# Altium schematic sheet MCU.SchDoc
size A
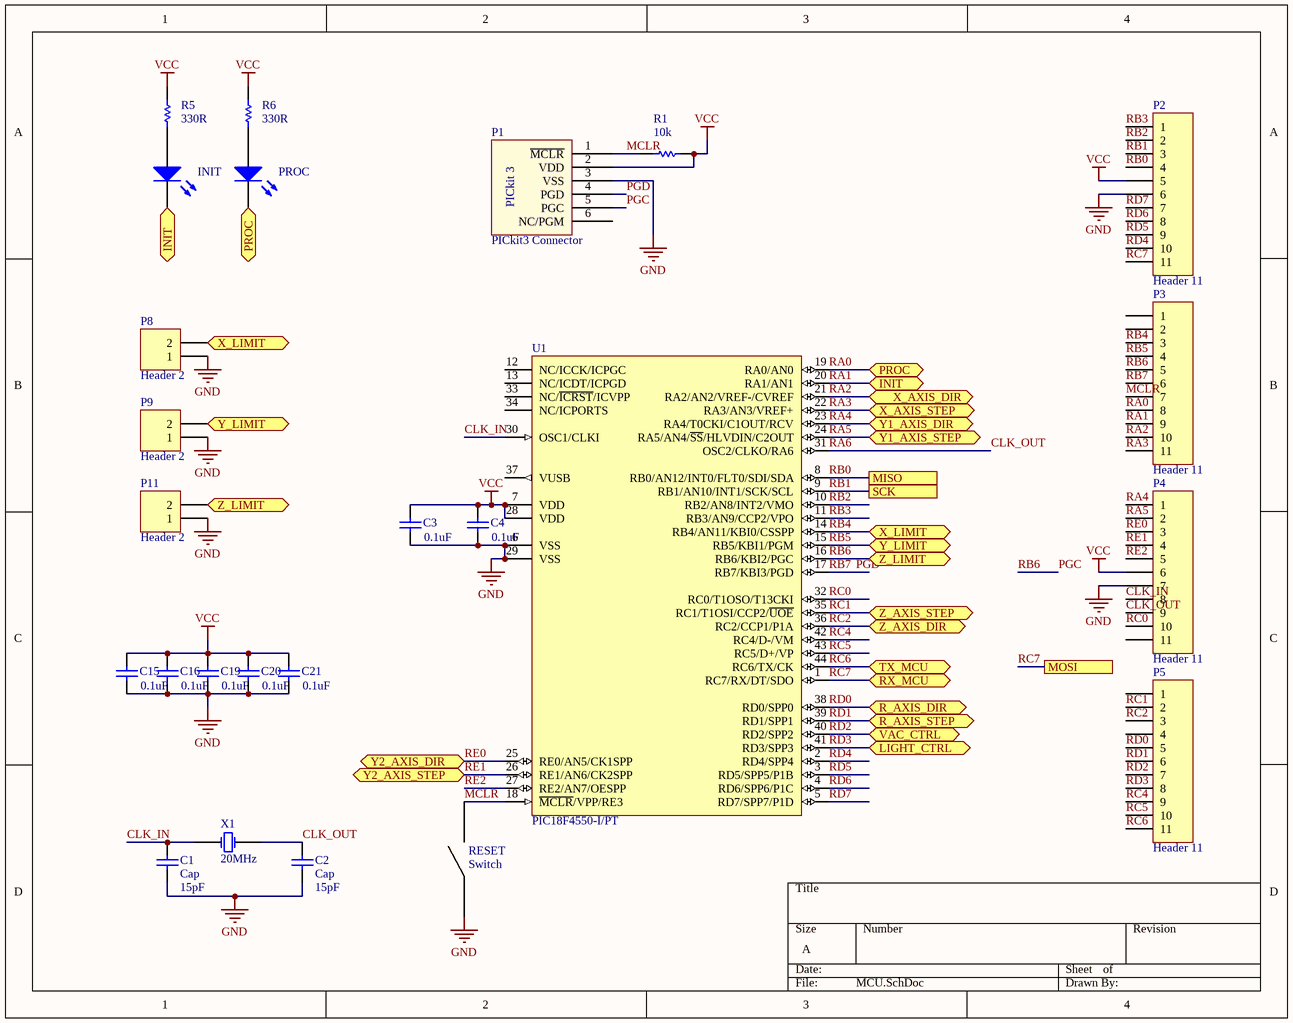
[diagram p0: MCU.SchDoc]

## Parts
C1  Cap  value 15pF  [0603]
C2  Cap  value 15pF  [0603]
C3  value 0.1uF  [0805]  (hidden comment: Cap)
C4  value 0.1uF  [0805]  (hidden comment: Cap)
C15  value 0.1uF  [0805]  (hidden comment: Cap)
C16  value 0.1uF  [0805]  (hidden comment: Cap)
C19  value 0.1uF  [0805]  (hidden comment: Cap)
C20  value 0.1uF  [0805]  (hidden comment: Cap)
C21  value 0.1uF  [0805]  (hidden comment: Cap)
INIT  LED1  [0805]  (value not drawn)
P1  PICkit3 Connector  [Right Angle PICkit Connector]
P2  Header 11  [HDR1X11]
P3  Header 11  [HDR1X11]
P4  Header 11  [HDR1X11]
P5  Header 11  [HDR1X11]
P8  Header 2  [HDR1X2]
P9  Header 2  [HDR1X2]
P11  Header 2  [HDR1X2]
PROC  LED2  [0805]  (value not drawn)
R1  value 10k  [0805]  (hidden comment: Res1)
R5  value 330R  [6-0805_N]  (hidden comment: Res1)
R6  value 330R  [6-0805_N]  (hidden comment: Res1)
RESET  Switch  [TACT_SWITCH]
U1  PIC18F4550-I/PT  [TQFP-PT44_N]
X1  Frequency: 20MHz  [HC49-US]  (hidden comment: Crystal)

## Ports
INIT, LIGHT_CTRL, MISO, MOSI, PROC, R_AXIS_DIR, R_AXIS_STEP, RX_MCU, SCK, TX_MCU, VAC_CTRL, X_AXIS_DIR, X_AXIS_STEP, X_LIMIT, Y1_AXIS_DIR, Y1_AXIS_STEP, Y2_AXIS_DIR, Y2_AXIS_STEP, Y_LIMIT, Z_AXIS_DIR, Z_AXIS_STEP, Z_LIMIT

## Nets
1: RESET.2
4: RESET.4
GND: C1.1 C2.1 C3.1 C4.1 C15.1 C16.1 C19.1 C20.1 C21.1 P1.3(VSS) P2.6 P4.7 P8.1 P9.1 P11.1 RESET.1 U1.6(VSS) U1.29(VSS)
VCC: C3.2 C4.2 C15.2 C16.2 C19.2 C20.2 C21.2 P1.2(VDD) P2.5 P4.6 R1.2 R5.2 R6.2 U1.7(VDD) U1.28(VDD)
CLK_IN: C1.2 P4.8 U1.30(OSC1/CLKI) X1.1(OSC1)
CLK_OUT: C2.2 P4.9 U1.31(OSC2/CLKO/RA6) X1.2(OSC2)  [also labelled RA6]
MCLR: P1.1(~{MCLR}) P3.7 R1.1 RESET.3 U1.18(~{MCLR}/VPP/RE3)
PGC: P1.5(PGC) P3.5 P11.2 U1.16(RB6/KBI2/PGC) ; port Z_LIMIT  [also labelled RB6]
PGD: P1.4(PGD) P3.6 U1.17(RB7/KBI3/PGD)  [also labelled RB7]
RA0: P3.8 PROC.2(K) U1.19(RA0/AN0) ; port PROC
RA1: INIT.2(K) P3.9 U1.20(RA1/AN1) ; port INIT
RA2: P3.10 U1.21(RA2/AN2/VREF-/CVREF) ; port X_AXIS_DIR
RA3: P3.11 U1.22(RA3/AN3/VREF+) ; port X_AXIS_STEP
RA4: P4.1 U1.23(RA4/T0CKI/C1OUT/RCV) ; port Y1_AXIS_DIR
RA5: P4.2 U1.24(RA5/AN4/~{SS}/HLVDIN/C2OUT) ; port Y1_AXIS_STEP
RB0: P2.4 U1.8(RB0/AN12/INT0/FLT0/SDI/SDA) ; port MISO
RB1: P2.3 U1.9(RB1/AN10/INT1/SCK/SCL) ; port SCK
RB2: P2.2 U1.10(RB2/AN8/INT2/VMO)
RB3: P2.1 U1.11(RB3/AN9/CCP2/VPO)
RB4: P3.3 P8.2 U1.14(RB4/AN11/KBI0/CSSPP) ; port X_LIMIT
RB5: P3.4 P9.2 U1.15(RB5/KBI1/PGM) ; port Y_LIMIT
RC0: P4.10 U1.32(RC0/T1OSO/T13CKI)
RC1: P5.2 U1.35(RC1/T1OSI/CCP2/~{UOE}) ; port Z_AXIS_STEP
RC2: P5.3 U1.36(RC2/CCP1/P1A) ; port Z_AXIS_DIR
RC4: P5.9 U1.42(RC4/D-/VM)
RC5: P5.10 U1.43(RC5/D+/VP)
RC6: P5.11 U1.44(RC6/TX/CK) ; port TX_MCU
RC7: P2.11 U1.1(RC7/RX/DT/SDO) ; port MOSI, port RX_MCU
RD0: P5.5 U1.38(RD0/SPP0) ; port R_AXIS_DIR
RD1: P5.6 U1.39(RD1/SPP1) ; port R_AXIS_STEP
RD2: P5.7 U1.40(RD2/SPP2) ; port VAC_CTRL
RD3: P5.8 U1.41(RD3/SPP3) ; port LIGHT_CTRL
RD4: P2.10 U1.2(RD4/SPP4)
RD5: P2.9 U1.3(RD5/SPP5/P1B)
RD6: P2.8 U1.4(RD6/SPP6/P1C)
RD7: P2.7 U1.5(RD7/SPP7/P1D)
RE0: P4.3 U1.25(RE0/AN5/CK1SPP) ; port Y2_AXIS_DIR
RE1: P4.4 U1.26(RE1/AN6/CK2SPP) ; port Y2_AXIS_STEP
RE2: P4.5 U1.27(RE2/AN7/OESPP)
NetINIT_1: INIT.1(A) R5.1
NetPROC_1: PROC.1(A) R6.1

Not connected (* = marked no-connect by the designer): P1 6(NC/PGM); P3 1 2; P4 11; P5 1 4; U1 12(NC/ICCK/ICPGC) 13(NC/ICDT/ICPGD) 33(NC/~{ICRST}/ICVPP) 34(NC/ICPORTS) 37(VUSB)

## Notes on the sheet
- (in symbol PICkit 3 Connector) PICkit 3

## Library data of the parts
C1-C4 C15 C16 C19-C21 = Cap: Capacitor; Published: 8-Jun-2000; LatestRevisionDate: 17-Jul-2002; LatestRevisionNote: Re-released for DXP Platform.; PackageReference: RAD-0.3; Publisher: Altium Limited; PackageDescription: Radial Cap, Thru-Hole; 2 Leads; 0.3 in Pin Spacing
INIT PROC = LED0: Typical INFRARED GaAs LED; Published: 8-Jun-2000; LatestRevisionDate: 08-Jul-2005; LatestRevisionNote: Mech Layer 1 removed.; PackageReference: LED-0; Publisher: Altium Limited; PackageDescription: LED; 2 Leads
P1 = PICkit 3 Connector
P2-P5 = Header 11: Header, 11-Pin; LatestRevisionDate: 17-Jul-2002; LatestRevisionNote: Re-released for DXP Platform.; Publisher: Altium Limited
P8 P9 P11 = Header 2: Header, 2-Pin; LatestRevisionDate: 17-Jul-2002; LatestRevisionNote: Re-released for DXP Platform.; Publisher: Altium Limited
R1 R5 R6 = Res1: Resistor; Published: 8-Jun-2000; LatestRevisionDate: 17-Jul-2002; LatestRevisionNote: Re-released for DXP Platform.; PackageReference: AXIAL-0.3; Publisher: Altium Limited; PackageDescription: Axial Device, Thru-Hole; 2 Leads; 0.3 in Pin Spacing
RESET = Switch: Manufacturer Part No.: PTS645SM43SMTR92 LFS; Digi-Key Part No.: CKN9112CT-ND
U1 = PIC18F4550-I/PT: High Performance, Enhanced Flash, USB Microcontroller with nanoWatt Technology, 32K Flash, 44-Pin TQFP, Industrial Temperature Range; Published: 29-Jan-2009; LatestRevisionDate: 02-Dec-2009; LatestRevisionNote: Updated to datasheet revision E, Aug-2008; DatasheetVersion: revE, Aug-2008; PackageVersion: revBB, Aug-2009; PackageReference: TQFP-PT44; Publisher: Altium Limited; PackageDescription: 44-Lead Plastic Thin Quad Flatpack (PT) - 10x10x1mm Body, 2.00mm [TQFP]; Supplier 1: Digi-Key; Supplier Part Number 1: PIC18F4550-I/PT-ND; Supplier 2: Farnell; Supplier Part Number 2: 9321365; Supplier 3: Farnell; Supplier Part Number 3: 1528447; Code_JEDEC: MS-026; ComponentLink1Description: Datasheet; ComponentLink1URL: http://ww1.microchip.com/downloads/en/DeviceDoc/39632e.pdf; ComponentLink2Description: Packaging Specification; ComponentLink2URL: http://www.microchip.com/stellent/groups/techpub_sg/documents/packagingspec/en012702.pdf; ComponentLink3Description: Microchip.com Home; ComponentLink3URL: http://www.microchip.com/
X1 = Crystal 2-pin: 2-pin crystal resonator